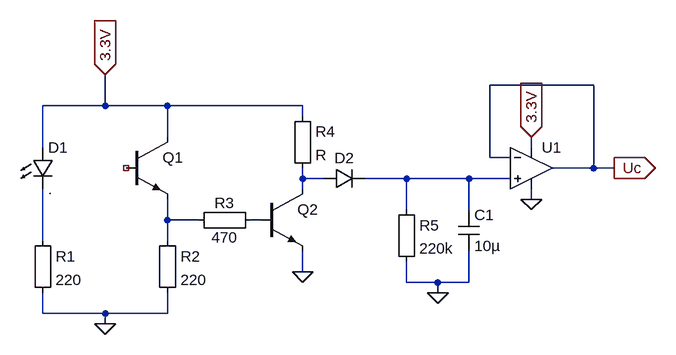
[diagram p0: schematic Lichtschranke_1.asc]
Lichtschranke_1.asc, the LTspice schematic file:
Version 4
SHEET 1 1080 680
WIRE 960 80 800 80
WIRE 208 112 208 64
WIRE 208 112 112 112
WIRE 304 112 208 112
WIRE 512 112 304 112
WIRE 512 128 512 112
WIRE 304 160 304 112
WIRE 112 176 112 112
WIRE 864 176 864 160
WIRE 800 192 800 80
WIRE 832 192 800 192
WIRE 960 208 960 80
WIRE 960 208 896 208
WIRE 992 208 960 208
WIRE 512 224 512 208
WIRE 544 224 512 224
WIRE 672 224 608 224
WIRE 768 224 672 224
WIRE 832 224 768 224
WIRE 512 240 512 224
WIRE 864 256 864 240
WIRE 672 272 672 224
WIRE 768 272 768 224
WIRE 304 288 304 256
WIRE 352 288 304 288
WIRE 448 288 432 288
WIRE 112 320 112 240
WIRE 304 320 304 288
WIRE 512 368 512 336
WIRE 672 384 672 352
WIRE 720 384 672 384
WIRE 768 384 768 336
WIRE 768 384 720 384
WIRE 720 400 720 384
WIRE 112 432 112 400
WIRE 208 432 112 432
WIRE 304 432 304 400
WIRE 304 432 208 432
WIRE 208 448 208 432
FLAG 208 64 3.3V
IOPIN 208 64 In
FLAG 208 448 0
FLAG 512 368 0
FLAG 720 400 0
FLAG 864 256 0
FLAG 864 160 3.3V
IOPIN 864 160 In
FLAG 992 208 Uc
IOPIN 992 208 Out
SYMBOL LED 96 176 R0
SYMATTR InstName D1
SYMATTR Value .
SYMBOL npn 240 160 R0
SYMATTR InstName Q1
SYMATTR Value ""
SYMBOL Misc\\EuropeanResistor 96 304 R0
SYMATTR InstName R1
SYMATTR Value 220
SYMBOL Misc\\EuropeanResistor 288 304 R0
SYMATTR InstName R2
SYMATTR Value 220
SYMBOL Misc\\EuropeanResistor 448 272 R90
WINDOW 0 5 56 VBottom 2
WINDOW 3 27 56 VTop 2
SYMATTR InstName R3
SYMATTR Value 470
SYMBOL npn 448 240 R0
SYMATTR InstName Q2
SYMATTR Value ""
SYMBOL Misc\\EuropeanResistor 496 112 R0
SYMATTR InstName R4
SYMBOL diode 544 240 R270
WINDOW 0 32 32 VTop 2
WINDOW 3 0 32 VBottom 2
SYMATTR InstName D2
SYMATTR Value ""
SYMBOL Misc\\EuropeanResistor 656 256 R0
SYMATTR InstName R5
SYMATTR Value 220k
SYMBOL cap 752 272 R0
SYMATTR InstName C1
SYMATTR Value 10µ
SYMBOL Opamps\\opamp2 864 144 R0
SYMATTR InstName U1
SYMATTR Value ""

The netlist it stands for:
* Lichtschranke_1.asc
D1 3.3V N005 .
Q1 3.3V NC_01 N003 0
R1 N005 0 220
R2 N003 0 220
R3 N004 N003 470
Q2 N001 N004 0 0
R4 3.3V N001 R
D2 N001 N002
R5 N002 0 220k
C1 N002 0 10µ
XU1 N002 Uc 3.3V 0 Uc opamp2  ; pins In+ In- V+ V- OUT
.model D D
.lib standard.dio
.model NPN NPN
.model PNP PNP
.lib standard.bjt
.backanno
.end